# Altium schematic sheet Power.SchDoc: Alimentación
size A4; Date: *******; ApprovedBy: *******; CheckedBy: Mario de Miguel; Author: *******; CompanyName: *******; DrawnBy: Alberte Gil; Engineer: *******; Organization: *******; Address1: *******; Address2: *******; Address3: *******; Address4: *******; DocumentNumber: 2; Revision: *******; SheetNumber: 2; SheetTotal: 5; CurrentTime: *******; CurrentDate: *******; Time: *******; DocumentFullPathAndName: *******; DocumentName: *******; ModifiedDate: *******; ImagePath: *******; ProjectName: *******; Application_BuildNumber: *******
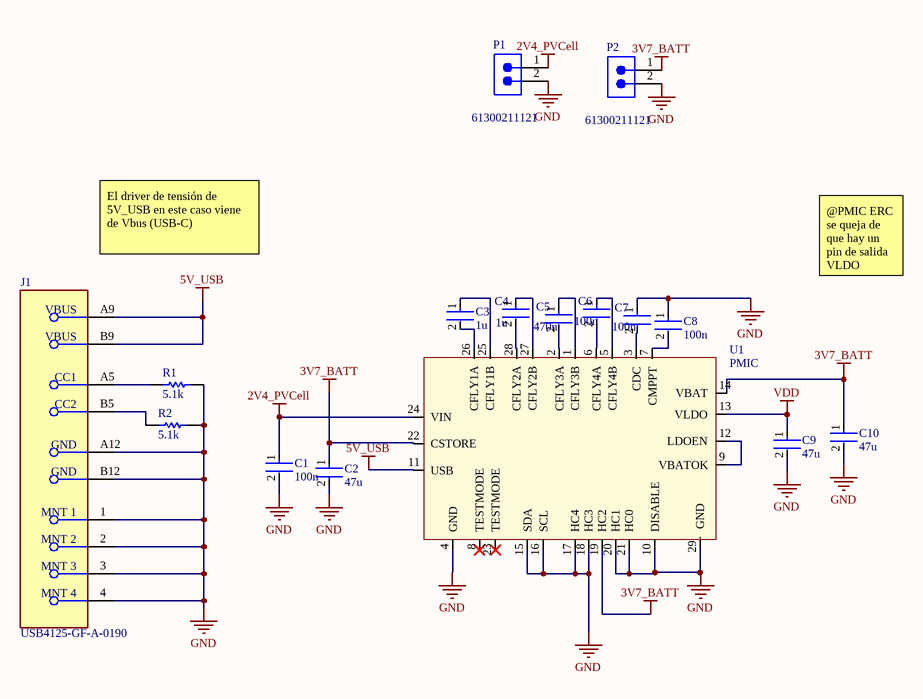
[diagram p0: Power.SchDoc]

## Parts
C1  100n  [FP-GRM033-0_03-MFG]
C2  47u  [FP-GRM188-0_2-IPC_B]
C3  1u  [FP-GRM033-0_05-e01_0_2-IPC_B]
C4  1u  [FP-GRM033-0_05-e01_0_2-IPC_B]
C5  470n  [FP-GRM033-0_03-IPC_C]
C6  100n  [FP-GRM033-0_03-MFG]
C7  100n  [FP-GRM033-0_03-MFG]
C8  100n  [FP-GRM033-0_03-MFG]
C9  47u  [FP-GRM188-0_2-IPC_B]
C10  47u  [FP-GRM188-0_2-IPC_B]
J1  USB4125-GF-A-0190  [FP-USB4125-GF-A-0190-MFG]
P1  61300211121  [61300211121]
P2  61300211121  [61300211121]
R1  5.1k  [RESC1608X55X25ML10T15]
R2  5.1k  [RESC1608X55X25ML10T15]
U1  PMIC  [HVQFN-28]

## Nets
2V4_PVCell: C1.1 P1.1 U1.24(VIN)
3V7_BATT: C2.1 C10.1 P2.1 U1.14(VBAT) U1.19(HC2) U1.22(CSTORE)
5V_USB: J1.A9(VBUS) J1.B9(VBUS) U1.11(USB)
GND: C1.2 C2.2 C7.1 C8.1 C9.2 C10.2 J1.1(MNT_1) J1.2(MNT_2) J1.3(MNT_3) J1.4(MNT_4) J1.A12(GND) J1.B12(GND) P1.2 P2.2 R1.2 R2.2 U1.4(GND) U1.10(DISABLE) U1.15(SDA) U1.16(SCL) U1.17(HC4) U1.18(HC3) U1.21(HC0) U1.29(GND)
VDD: C9.1 U1.13(VLDO)
NetC3_1: C3.1 U1.25(CFLY1B)
NetC3_2: C3.2 U1.26(CFLY1A)
NetC4_1: C4.1 U1.27(CFLY2B)
NetC4_2: C4.2 U1.28(CFLY2A)
NetC5_1: C5.1 U1.1(CFLY3B)
NetC5_2: C5.2 U1.2(CFLY3A)
NetC6_1: C6.1 U1.5(CFLY4B)
NetC6_2: C6.2 U1.6(CFLY4A)
NetC7_2: C7.2 U1.3(CDC)
NetC8_2: C8.2 U1.7(CMPPT)
NetJ1_A5: J1.A5(CC1) R1.1
NetJ1_B5: J1.B5(CC2) R2.1
NetU1_9: U1.9(VBATOK) U1.12(LDOEN)

Not connected (* = marked no-connect by the designer): U1 8(TESTMODE)* 20(HC1) 23(TESTMODE)*

## Notes on the sheet
- El driver de tensión de 5V_USB en este caso viene de Vbus (USB-C)
- @PMIC ERC se queja de que hay un pin de salida VLDO enchufado a la VDD de todo el circuito
- Title:
- Drawn By:
- Page Contents:
- Checked By:
- Size:
- Date:
- File:
- License:
- Email:
- A4
- Number:
- Time:
- Revision:
- Sheet
- Website:
- of

## Library data of the parts
C1 C6-C8 = CMP-06035-019037-1: Chip Multilayer Ceramic Capacitors for General Purpose, 0201, 0.10uF, X7S, 22%, 10%, 16V; Capacitance: 100nF; Dielectric: X7S; Tolerance: 10%; Voltage Rating (DC): 16V; Height: 0.3mm; Max Operating Temperature: 125°C; Case Code (Metric): 0603; Termination: SMD/SMT; Min Operating Temperature: -55°C; Mount: Surface Mount; Case/Package: 0201; Weight: 1.2E-05oz; Package Quantity: 15000; Length: 0.024inch; Voltage Rating: 16V; Case Code (Imperial): 0201; Packaging: Tape and Reel; Thickness: 0.013inch; Width: 0.3mm
C2 C9 C10 = CMP-2000-05444-2: Chip Multilayer Ceramic Capacitors for General Purpose, 0603, 47uF, X5R, 15%, 20%, 6.3V; Voltage Rating (DC): 6.3V; Thickness: 0.039inch; Case Code (Imperial): 0603; Packaging: Tape and Reel; Capacitance: 47uF; Width: 0.031inch; Dielectric: X5R; Max Operating Temperature: 85°C; Mount: Surface Mount; Case Code (Metric): 1608; Length: 0.063inch; Voltage Rating: 6.3V; Tolerance: 20%; Case/Package: 0603; Min Operating Temperature: -55°C
C3 C4 = CMP-06035-049033-1: Chip Multilayer Ceramic Capacitors for General Purpose, 0201, 1.0uF, X5R, 15%, 20%, 6.3V; Capacitance: 1uF; Max Operating Temperature: 85°C; Depth: 0.3mm; Case Code (Imperial): 0201; Voltage Rating (DC): 6.3V; Height: 0.3mm; Mount: Surface Mount; Weight: 1.2E-05oz; Packaging: Cut Tape; Dielectric: X5R; Width: 0.3mm; REACH SVHC: No SVHC; Package Quantity: 1; Case Code (Metric): 0603; Min Operating Temperature: -55°C; Case/Package: 0201; Tolerance: 20%; Thickness: 300um; Lead Free: Lead Free; Length: 0.6mm; Termination: SMD/SMT; Voltage: 6.3V; Voltage Rating: 6.3V
C5 = CMP-06035-010465-1: Chip Multilayer Ceramic Capacitors for General Purpose, 0201, 0.47uF, X5R, 15%, 10%, 6.3V; Capacitance: 470nF; Thickness: 0.013inch; Depth: 0.3mm; Height: 0.3mm; Mount: Surface Mount; Max Operating Temperature: 85°C; Tolerance: 10%; Dielectric: X5R; Length: 0.6mm; Package Quantity: 15000; Weight: 1.2E-05oz; Voltage Rating (DC): 6.3V; Lead Free: Lead Free; Termination: SMD/SMT; Voltage Rating: 6.3V; Case Code (Imperial): 0201; Width: 0.012inch; Case/Package: 0201; Case Code (Metric): 0603; Min Operating Temperature: -55°C; Packaging: Tape and Reel
J1 = CMP-245163-000004-1: CONN RCPT TYPE C 6P SMD RA
P1 P2 = CMP-1712-00002-6: NexarPartId: 20081794; Number of Contacts: 2; Pitch: 2.54mm; Connector Type: Male Pin; Voltage Rating: 250V; Current Rating: 3A; Gender: Male; Contact Resistance: 20mΩ; Height: 8.94mm; Lead Free: Lead Free; Number of Pins: 2; Termination: Through Hole; RoHS: Compliant; Lead Pitch: 2.54mm; REACH SVHC: No SVHC; Housing Material: PBT; Contact Mating Length: 5.9944mm; Min Operating Temperature: -40°C; Orientation: Vertical; Contact Material: Copper; Contact Gender: Male; Max Operating Temperature: 125°C; Number of Rows: 1; Number of Positions: 2; Packaging: Bulk; Contact Plating: Gold; Mount: Through Hole; Color: Black; Operating Supply Voltage: 250V
R1 R2 = CMP-2000-04091-1: Manufacturer: Yageo; Part Number: RC0603FR-075K1L
U1 = NEH7100BU: Power Management Specialised - PMIC Inductorless energy harvesting PMIC with battery protection, LDO and USB charging